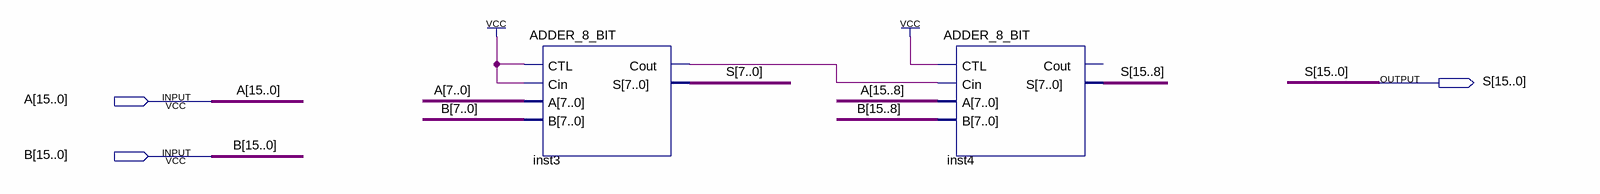
[diagram p0: schematic sheet]
// Quartus schematic SUB_16_BIT.bdf as structural Verilog: 2 symbols, 3 pins
module SUB_16_BIT (
  input  [15:0] A,
  input  [15:0] B,
  output [15:0] S
);

  wire inst3_cout;

  ADDER_8_BIT inst3 (.CTL(1'b1), .Cin(1'b1), .A(A[7:0]), .B(B[7:0]), .Cout(inst3_cout), .S(S[7:0]));
  ADDER_8_BIT inst4 (.CTL(1'b1), .Cin(inst3_cout), .A(A[15:8]), .B(B[15:8]), .S(S[15:8]));  // open: Cout
endmodule
